# Altium schematic sheet MCU.SchDoc
size A4; SheetNumber: 7; SheetTotal: 9
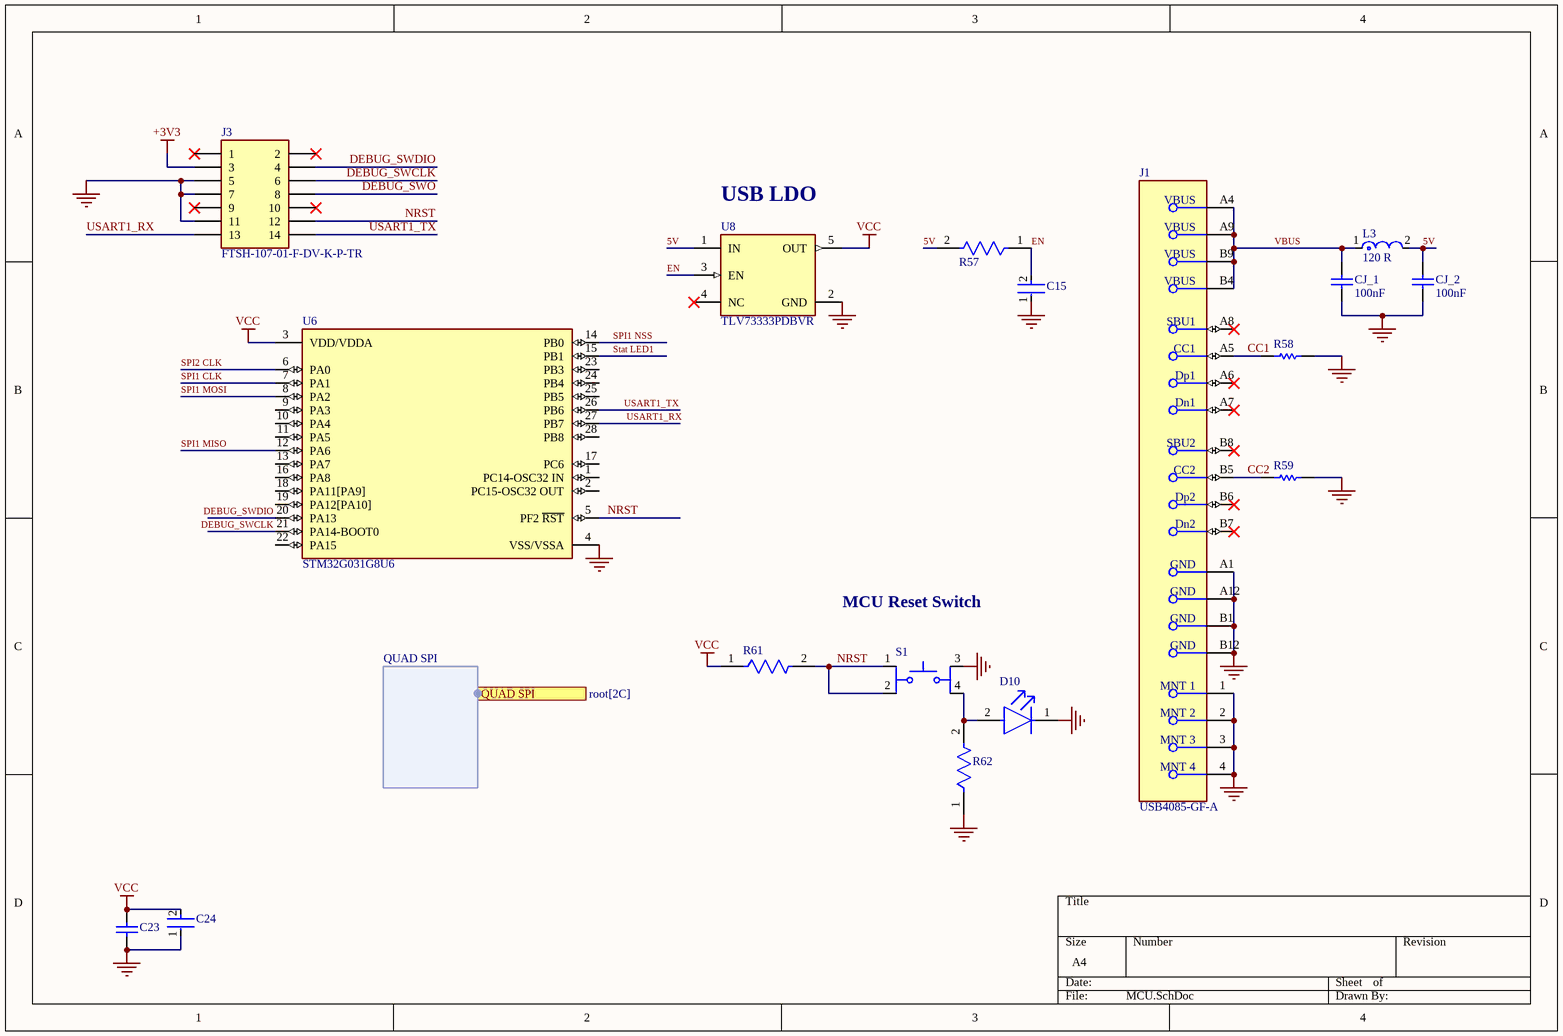
[diagram p0: MCU.SchDoc]

## Parts
C15  C1608X5R1H105K080AB  [FP-C1608-080-0_1-IPC_B]  (value not drawn)
C23  LD033C104KAB2A  [CAPC1608X90X35NL15T15]  (value not drawn)
C24  GRM219R61E475MA73J  [FP-GRM219-0_15-0_1-IPC_B]  (value not drawn)
CJ_1  100nF  [CAPC1206(3216)170_L]
CJ_2  100nF  [CAPC1206(3216)170_L]
D10  LTST-C170GKT  [FP-LTST-C170GKT-MFG]  (value not drawn)
J1  USB4085-GF-A  [FP-USB4085-GF-A-MFG]
J3  FTSH-107-01-F-DV-K-P-TR  [FTSH-107-XX-YYY-DV-K-P-TR]
L3  120 R  [FP-LQG15HH_02-MFG]
R57  RC0603FR-0710KL  [FP-RC0603-0_55-IPC_C]  (value not drawn)
R58  RC0603FR-075K1L  [RESC1608X55X25ML10T15]  (value not drawn)
R59  RC0603FR-075K1L  [RESC1608X55X25ML10T15]  (value not drawn)
R61  AC0603JR-0747KL  [FP-AC0603-IPC_A]  (value not drawn)
R62  TFCR0402-16W-C-1002BT  [FP-TFCR0402-IPC_B]  (value not drawn)
S1  TL3365AF180QG  [SW_TL3365AF180QG]  (value not drawn)
U6  STM32G031G8U6  [FP-UFQFPN28-A0B0-MFG]
U8  TLV73333PDBVR  [FP-DBV0005A-MFG]

## Ports
QUAD SPI (harness QUAD SPI, see root[2C])

## Harnesses
QUAD SPI: 

## Nets
+3V3: J3.3
GND: C15.1 C23.1 C24.1 CJ_1.1 CJ_2.1 D10.1(C) J1.1(MNT_1) J1.2(MNT_2) J1.3(MNT_3) J1.4(MNT_4) J1.A1(GND) J1.A12(GND) J1.B1(GND) J1.B12(GND) J3.5 J3.7 J3.11 R58.2 R59.2 R62.1 S1.3 U6.4(VSS/VSSA) U8.2(GND)
VCC: C23.2 C24.2 R61.1 U6.3(VDD/VDDA) U8.5(OUT)
5V: CJ_2.2 L3.2 R57.2 U8.1(IN)
CC1: J1.A5(CC1) R58.1
CC2: J1.B5(CC2) R59.1
DEBUG_SWCLK: J3.6 U6.21(PA14-BOOT0)
DEBUG_SWDIO: J3.4 U6.20(PA13)
DEBUG_SWO: J3.8
EN: C15.2 R57.1 U8.3(EN)
NRST: J3.12 R61.2 S1.1 S1.2 U6.5(PF2_~{RST})
SPI1 CLK: U6.7(PA1)
SPI1 MISO: U6.12(PA6)
SPI1 MOSI: U6.8(PA2)
SPI1 NSS: U6.14(PB0)
SPI2 CLK: U6.6(PA0)
Stat LED1: U6.15(PB1)
USART1_RX: J3.13 U6.27(PB7)
USART1_TX: J3.14 U6.26(PB6)
VBUS: CJ_1.2 J1.A4(VBUS) J1.A9(VBUS) J1.B4(VBUS) J1.B9(VBUS) L3.1
NetD10_2: D10.2(A) R62.2 S1.4

Not connected (* = marked no-connect by the designer): J1 A6(Dp1)* A7(Dn1)* A8(SBU1)* B6(Dp2)* B7(Dn2)* B8(SBU2)*; J3 1* 2* 9* 10*; U6 1(PC14-OSC32_IN) 2(PC15-OSC32_OUT) 9(PA3) 10(PA4) 11(PA5) 13(PA7) 16(PA8) 17(PC6) 18(PA11[PA9]) 19(PA12[PA10]) 22(PA15) 23(PB3) 24(PB4) 25(PB5) 28(PB8); U8 4(NC)*

## Notes on the sheet
- (near U8) USB LDO
- MCU Reset Switch

## Library data of the parts
C15 = CMP-2000-06025-2: Multilayer Ceramic Capacitors 1μF ±10% 50V X5R SMD 0603; Capacitance: 1uF; Lead Free: Lead Free; Height: 0.8mm; Mount: Surface Mount; Radiation Hardening: No; Thickness: 0.035inch; Length: 1.6mm; Max Operating Temperature: 85°C; REACH SVHC: No SVHC; Min Operating Temperature: -55°C; Construction: Flat; RoHS Compliant: Yes; Voltage Rating: 50V; Dielectric: X5R; Packaging: Tape and Reel; Termination: SMD/SMT; Voltage Rating (DC): 50V; Case Code (Imperial): 0603; Voltage: 50V; Width: 0.031inch; Weight: 7.1E-05oz; Depth: 0.8mm; Case Code (Metric): 1608; Series: C; Case/Package: 0603; Tolerance: 10%; Resistor Type: Ceramic; Number of Pins: 2; Dielectric Material: Ceramic; Package Quantity: 1
C23 = CMP-2006-02157-1: Manufacturer: AVX Interconnect / Elco; Part Number: LD033C104KAB2A
C24 = CMP-06035-028467-1: Chip Multilayer Ceramic Capacitors for General Purpose, 0805, 4.7uF, X5R, 15%, 20%, 25V
CJ_1 CJ_2 = CMP-1037-04188-1: CAP 100nF 25V ±5% 1206 (3216 Metric) Thickness 1.7mm SMD; Case-Metric: 3216; Case-EIA: 1206; Tolerance: Â±5%; Max Thickness: 1.7 mm; Value: 100nF; Technology: SMT; Rated Voltage: 25 V
D10 = CMP-1674-00002-6: LED GREEN CLEAR SMD; Dominant Wavelength: 569nm; Lens Style: Diffused; Forward Voltage: 2.1V; Number of Elements: 1; Wavelength: 565nm; Luminous Intensity: 6mcd; Test Current: 10mA; Power Dissipation: 100mW; Reverse Voltage: 5V; Forward Current: 30mA; Viewing Angle: 130°; Lens Color: Colorless; Min Operating Temperature: -55°C; Number of Pins: 2; Max Operating Temperature: 85°C; Color: Green; Radiation Hardening: No; Illumination Color: Green; Case Code (Metric): 2012; Lens Transparency: Clear; Case/Package: 0805; Width: 1.25mm; Case Code (Imperial): 0805; Package Quantity: 1; Height: 1.1mm; Depth: 1.25mm; Length: 2mm; Power Rating: 100mW; Lead Free: Lead Free; Number of LEDs: 1; Packaging: Tape and Reel; Mount: Surface Mount; Voltage: 5V
J1 = CMP-196119-000001-2: CONN RCPT USB2.0 TYPE C 24POS RA; Gender: Receptacle; Number of Positions: 16; USB Standard: USB 2.0; Orientation: Right Angle; Contact Plating: Gold; Contact Material: Copper Alloy
J3 = FTSH-107-01-F-DV-K-P-TR: Connector Header Surface Mount 14 position 0.050" (1.27mm); Manufacturer_Name: SAMTEC; Datasheet Link: http://suddendocs.samtec.com/prints/ftsh-1xx-xx-xxx-dv-xxx-xxx-mkt.pdf; Manufacturer_Part_Number: FTSH-107-01-F-DV-K-P-TR; Mouser Part Number: 200-FTSH10701FDVKPTR; Mouser Price/Stock: https://www.mouser.co.uk/ProductDetail/Samtec/FTSH-107-01-F-DV-K-P-TR?qs=%252BZP6%2F%252BtExtAI0atx6lcXTg%3D%3D; Arrow Part Number: FTSH-107-01-F-DV-K-P-TR; Arrow Price/Stock: https://www.arrow.com/en/products/ftsh-107-01-f-dv-k-p-tr/samtec?utm_currency=USD&region=nac; LCSC Part #: C5276598; Manu Part #: FTSH-107-01-F-DV-K-P-TR
L3 = CMP-06042-008586-1: Multilayer type RF Inductor 8.2nH ±5% 0.25Ω 500mA 0402; Core Material: Air; Shielding: Unshielded; Current Rating: 300mA; Test Frequency: 100MHz; Self Resonant Frequency: 3.6GHz; Q Factor: 8; DC Resistance (DCR): 330mR; Case/Package: 0402; Max Operating Temperature: 125°C; Military Standard: Not; Depth: 0.55mm; Lead Free: Lead Free; DC Current: 300mA; Length: 1mm; Height: 0.02inch; Width: 0.5mm; Termination: SMD/SMT; Max DC Current: 300mA; Min Operating Temperature: -55°C; Height - Seated (Max): 0.022inch; Radiation Hardening: No; Inductance: 8.2nH; Packaging: Tape and Reel; REACH SVHC: No SVHC; Case Code (Imperial): 0402; Package Quantity: 1; Tolerance: 5%; Case Code (Metric): 1005; Mount: Surface Mount; Inductance Tolerance: 5%
R57 = CMP-2100-03664-2: RES 10K OHM 1% 1/10W 0603; Voltage Rating: 75V; Voltage Rating (DC): 50V; Resistance: 10kR; Power Rating: 100mW; Temperature Coefficient: 100ppm/°C; Depth: 0.8mm; Termination: SMD/SMT; Resistor Type: Thick Film; Series: RC; Construction: Rectangular; Features: Moisture Resistant; Packaging: Tape and Reel; Min Operating Temperature: -55°C; Number of Terminations: 2; Lead Pitch: 0.3mm; RoHS Compliant: Yes; Case/Package: 0603; Resistance Tolerance: 1%; Military Standard: Not; Weight: 7.1E-05oz; Number of Pins: 2; Tolerance: 1%; Length: 1.6mm; Case Code (Imperial): 0603; Lead Free: Lead Free; Width: 0.8mm; Max Power Dissipation: 100mW; Height: 0.45mm; Max Operating Temperature: 155°C; Case Code (Metric): 1608; Size Code: 0603
R58 R59 = CMP-2000-04091-1: Manufacturer: Yageo; Part Number: RC0603FR-075K1L
R61 = CMP-03412-049221-1: RES 47kΩ 5.00% 0.1W 0603; Resistance: 47kR; Tolerance: 5%; Temperature Coefficient: 100ppm/°C; Max Power Dissipation: 100mW; Voltage Rating: 50V; Packaging: Tape and Reel; Series: AC; Ratings: AEC-Q200; Case Code (Metric): 1608; Case Code (Imperial): 0603; Resistor Type: Thick Film; Max Operating Temperature: 155°C; Case/Package: 0603; Features: Moisture Resistant; Height: 0.45mm; Termination: SMD/SMT; Length: 1.6mm; Min Operating Temperature: -55°C; Number of Terminations: 2; Width: 0.8mm; RoHS Compliant: Yes; Power Rating: 100mW
R62 = CMP-250906-167145-1: RES Thin Film,  10kΩ, 0.1%, 0.063W, 50ppm/°C, 0402
S1 = TL3365AF180QG: Tactile Switch SPST-NO Top Actuated Surface Mount; MF: E-Switch; SnapEDA_Link: https://www.snapeda.com/parts/TL3365AF180QG/E-Switch/view-part/?ref=snap; Package: None; Value: *; MP: TL3365AF180QG; Check_prices: https://www.snapeda.com/parts/TL3365AF180QG/E-Switch/view-part/?ref=eda
U6 = CMP-12105-000108-1: IC MCU 32BIT 64KB FLASH 28UFQFPN
U8 = CMP-04917-000053-1: IC REG LINEAR 3.3V 300MA SOT23-5; Manufacturer: Texas Instruments; Max Junction Temp: +125°C; Accuracy Percentage: 1%; Min Supply Voltage: 1.4V; Number Of Outputs: 1; Dropout Voltage: 125mV; Nominal Supply Current: 34uA; Max Supply Voltage: 5.5V; Output Type: Fixed; Standoff Height: 0mm; Digikey Description: IC REG LINEAR 3.3V 300MA SOT23-5; Manufacturer Part Number: TLV73333PDBVR; Temperature Range High: +125°C; Temperature: -40°C to +125°C; Output Current: 300mA; Mouser Description: LDO Voltage Regulators Capacitr-Free 300-mA 5-SOT-23 -40 to 125; Automotive: No; Height: 1.45mm; Device Class L3: Voltage Regulators - Linear; ComponentLink2Description: Datasheet; Device Class L1: Integrated Circuits (ICs); ComponentLink2URL: http://www.ti.com/lit/ds/symlink/tlv733p.pdf; Octopart: https://octopart.com/tlv73333pdbvr-texas+instruments-51080890; Temperature Range Low: -40°C; RoHS: TRUE; Lead Free: Yes; Output Voltage: 3.3V; Package: DBV0005A; Device Class L2: Power Management ICs; Category: IC